# EAGLE design v1-2 (EAGLE 5.11)
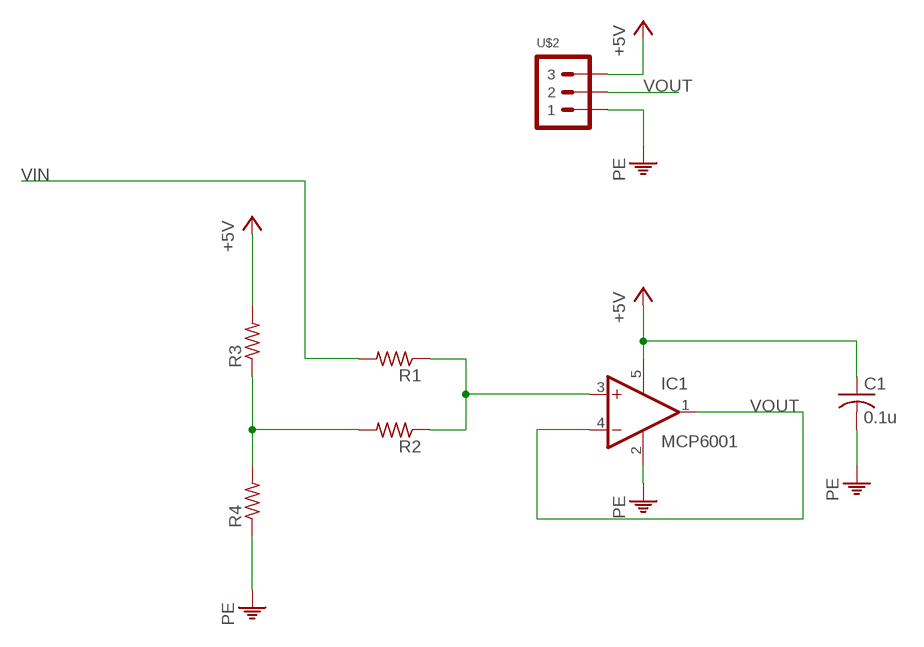
[diagram p0: schematic, sheet 1]

## Parts
C1  0.1u  C-USC0805  [C0805]
IC1  MCP6001  [SOT-23-5L]
R1  R-US_R0805  [R0805]
R2  R-US_R0805  [R0805]
R3  R-US_R0805  [R0805]
R4  R-US_R0805  [R0805]
U$2  HEADER-1X03  [HEADER-1X03]

## Nets
+5V: C1.1 IC1.5(V+) R3.2 U$2.3
N$1: R2.2 R3.1 R4.2
N$3: IC1.3(+IN) R1.1 R2.1
PE: C1.2 IC1.2(V-) R4.1 U$2.1
VIN: R1.2
VOUT: IC1.1(OUT) IC1.4(-IN) U$2.2

## Library data of the parts
C1 = rcl:C-US: CAPACITOR, American symbol
IC1 = Alan Rosenthal:MCP6001
R1-R4 = rcl:R-US_: RESISTOR, American symbol
U$2 = Alan Rosenthal:HEADER-1X03

## Board
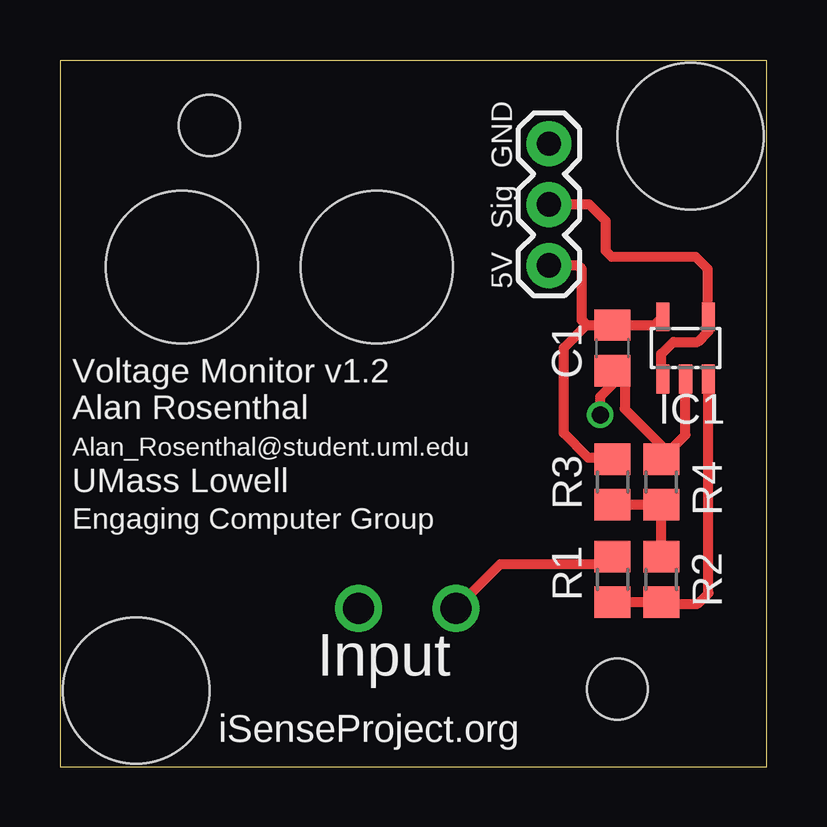
[diagram p1: board, top side]
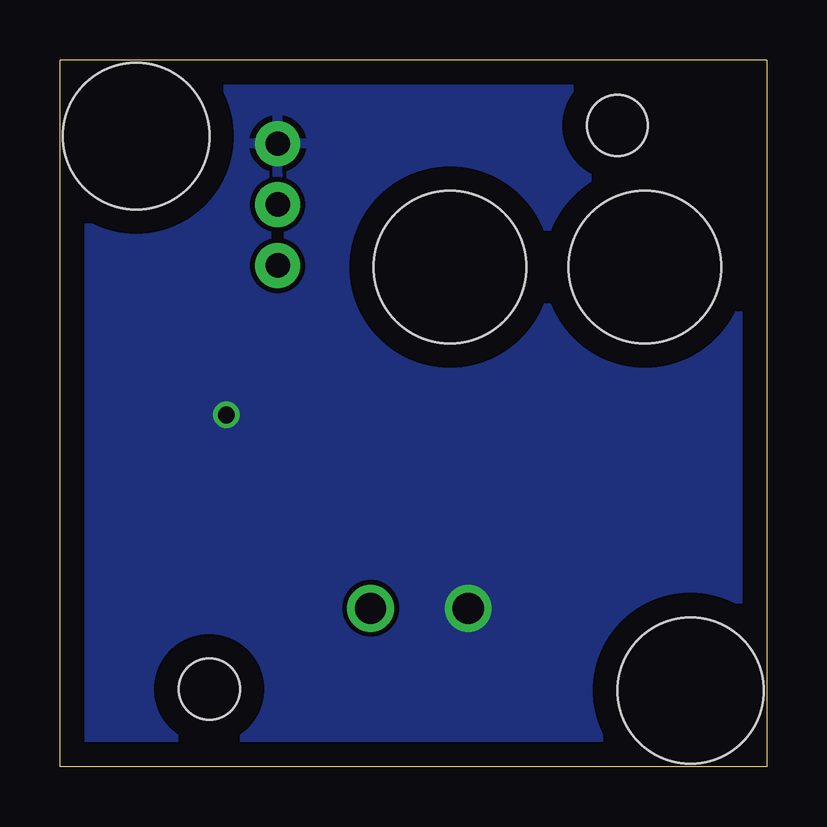
[diagram p2: board, bottom side, seen from below]

Size 29.46 x 29.46 mm. Coordinates in mm from the lower left corner, seen from the top.
Outline: 0,29.46 0,0 29.46,0 29.46,29.46 0,29.46
Copper layers (1*16): Top 0.035mm / dielectric 1.5mm / Bottom 0.035mm
Design rules "default": minimum track width 10mil, minimum drill 24mil, track to track 8mil, track to pad 8mil, pad to pad 8mil, via to via 8mil, smd to smd 8mil, copper to edge 40mil, drill to drill 8mil, minimum pad ring 10mil, minimum via ring 8mil, stop-mask expansion 4mil, vias tented up to drill 0mil, thermal gap 10mil
Holes 6.35 mm at 5.08,20.83 13.21,20.83
Holes 6.1 mm at 3.17,3.17 26.29,26.29
Holes 2.54 mm at 6.22,26.73 23.24,3.24

### Footprints (pad centres in the part's own frame; a part is rotated, then mirrored left to right if it is on the bottom)
C0805 = smd 1.3 x 1.5: 1 -0.95,0; 2 0.95,0
SOT-23-5L = smd 0.55 x 1.2: 1 -2.22,-1.3; 2 -1.27,-1.3; 3 -0.32,-1.3; 4 -0.32,1.3; 5 -2.22,1.3
R0805 = smd 1.3 x 1.5: 1 -0.95,0; 2 0.95,0
HEADER-1X03 = drill 1.016 pad 1.88 round: 1 -3.82,0; 2 -1.28,0; 3 1.26,0

### Placement (x,y rotation side)
C1  23.03,17.46 270 top
IC1  27.35,17.46 0 top
R1  23.03,7.81 90 top
R2  25.07,7.81 90 top
R3  23.03,11.87 90 top
R4  25.07,11.87 270 top
U$2  20.39,22.16 270 top

### Tracks (layer width: path | path; a pad name or v marks a point on that pad's centre or on a via)
+5V
  Top 0.406: IC1.5 24.78,18.41 C1.1 21.95,18.41 | 21.95,18.41 21,17.46 21,13.9 22.02,12.89 22.97,12.89 R3.2 | U$2.3 21.6,20.9 21.75,20.75 21.75,18.61 21.95,18.41
N$1
  Top 0.406: R2.2 R4.2 R3.1
N$3
  Top 0.406: IC1.3 27.03,7.23 26.59,6.79 25.13,6.79 R2.1 R1.1
PE  (via drill 0.7, 1.3)
  Top 0.406: IC1.2 26.08,13.84 R4.1 25.07,13.39 23.54,14.92 23.54,16 C1.2 | C1.2 23.03,16.44 | C1.2 23.03,16.19 | v22.53,14.66 22.53,15.43 23.03,15.93 C1.2
  other vias: 12.45,6.6
  pour Bottom: -0.51,29.72 29.97,29.72 29.97,-0.51 -0.51,-0.51
VIN  (via drill 1.3)
  Top 0.406: 22.97,8.82 R1.2 22.73,8.45 18.36,8.45 v16.51,6.6
VOUT
  Top 0.406: IC1.1 25.07,16.22 25.07,17.2 25.57,17.71 26.59,17.71 27.03,18.15 IC1.4 27,18.79 27,20.75 26.5,21.25 23,21.25 22.75,21.5 22.75,22.75 22.06,23.44 U$2.2

### Text on the board
tPlace: GND | Sig | 5V | Voltage Monitor v1.2 | Alan Rosenthal | Alan_Rosenthal@student.uml.edu | UMass Lowell | Engaging Computer Group | Input | iSenseProject.org